# Altium project MotorDriver.PrjPcb
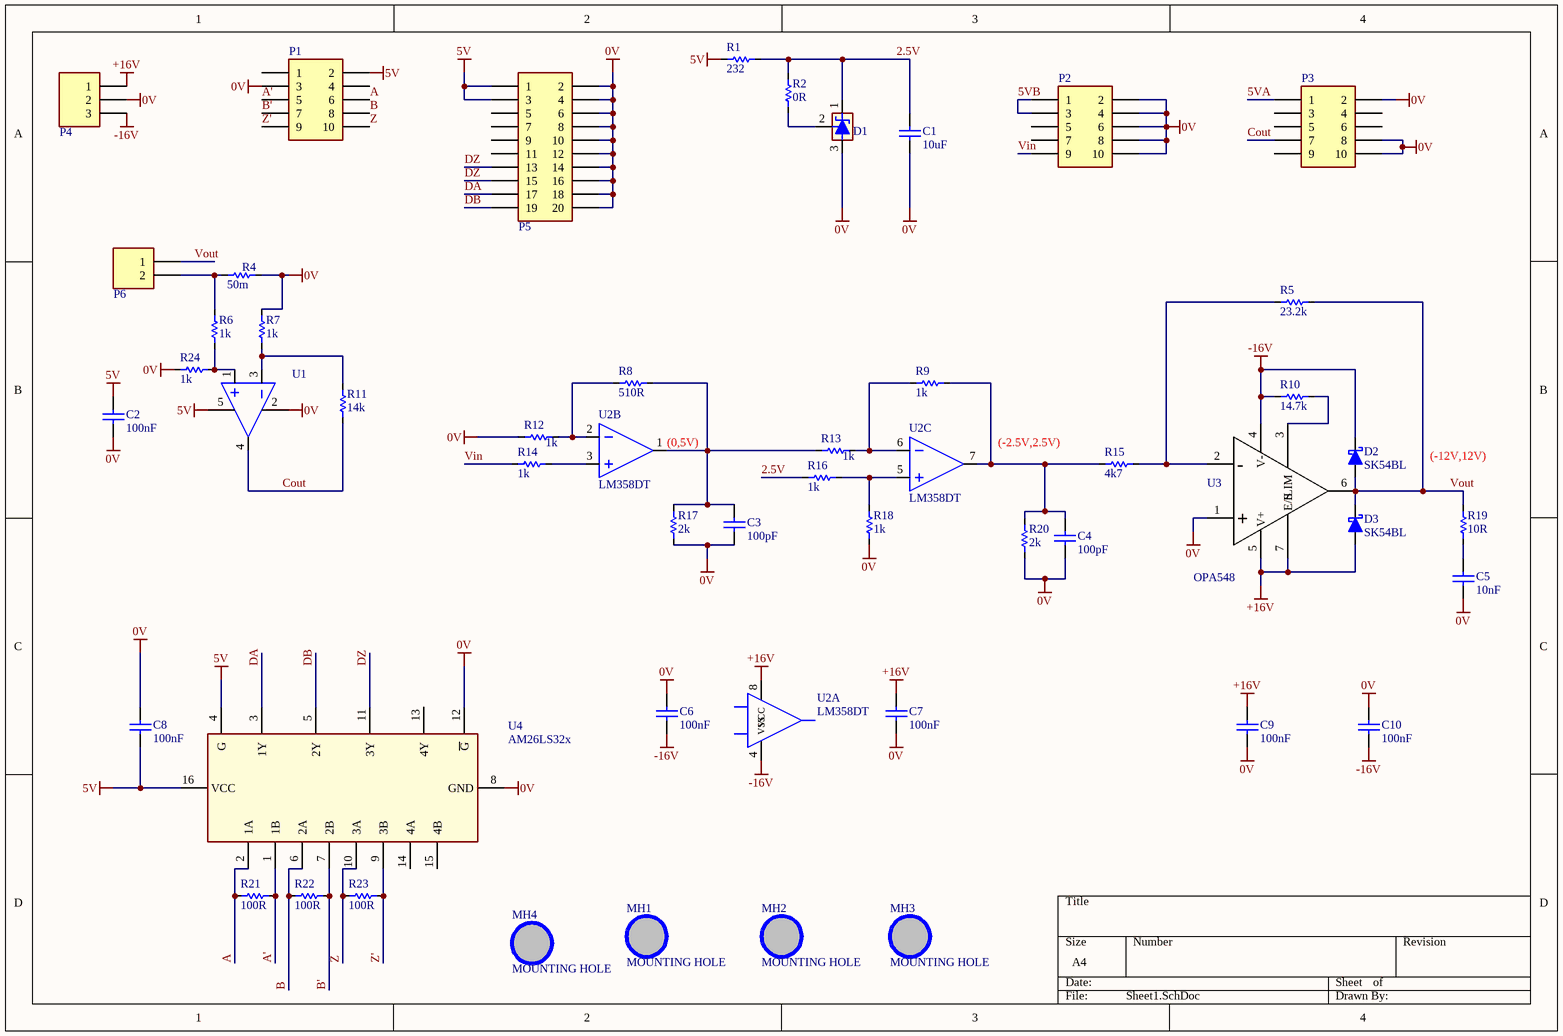
[diagram p0: Sheet1.SchDoc]
1 sheet, 50 parts. Net scope: global (net labels, ports and power ports of the same name join across sheets).
Board file: PCB.PcbDoc

## Sheet Sheet1.SchDoc
size A4; SheetNumber: 1; SheetTotal: 1

### Parts
C1  10uF  [CC3216-1206L]
C2  100nF  [CC3216-1206L]
C3  100pF  [CC3216-1206L]
C4  100pF  [CC3216-1206L]
C5  10nF  [CC3216-1206L]
C6  100nF  [CC3216-1206L]
C7  100nF  [CC3216-1206L]
C8  100nF  [CC3216-1206L]
C9  100nF  [CC3216-1206L]
C10  100nF  [CC3216-1206L]
D1  TL431  [SOT95P230X110-3N]  (value not drawn)
D2  SK54BL  [SMB]
D3  SK54BL  [SMB]
MH1  MOUNTING HOLE  [MOUNTING HOLE ROUND NONPLATED 3MM PLASTIC]  (no BOM)
MH2  MOUNTING HOLE  [MOUNTING HOLE ROUND NONPLATED 3MM PLASTIC]  (no BOM)
MH3  MOUNTING HOLE  [MOUNTING HOLE ROUND NONPLATED 3MM PLASTIC]  (no BOM)
MH4  MOUNTING HOLE  [MOUNTING HOLE ROUND NONPLATED 3MM PLASTIC]  (no BOM)
P1  CONNECTOR, 2x5, 5P  [HDR_BOX_2X5_10P_2.54MM_180]  (value not drawn)
P2  CONNECTOR, 2x5, 5P  [HDR_FEMALE_2X5_10P_2.54MM_180]  (value not drawn)
P3  CONNECTOR, 2x5, 5P  [HDR_FEMALE_2X5_10P_2.54MM_180]  (value not drawn)
P4  CONNECTOR, 1x3, 3P  [2EDGR-5.08-03P]  (value not drawn)
P5  CONNECTOR, 2x10, 20P  [HDR_MALE_2X10_20P_2.54MM_180]  (value not drawn)
P6  CONNECTOR, 1x2, 2P  [DG128-5.0-02P-14]  (value not drawn)
R1  232  [CR3216-1206l]
R2  0R  [CR3216-1206l]
R4  50m  [CR3216-1206l]
R5  23.2k  [CR3216-1206l]
R6  1k  [CR3216-1206l]
R7  1k  [CR3216-1206l]
R8  510R  [CR3216-1206l]
R9  1k  [CR3216-1206l]
R10  14.7k  [CR3216-1206l]
R11  14k  [CR3216-1206l]
R12  1k  [CR3216-1206l]
R13  1k  [CR3216-1206l]
R14  1k  [CR3216-1206l]
R15  4k7  [CR3216-1206l]
R16  1k  [CR3216-1206l]
R17  2k  [CR3216-1206l]
R18  1k  [CR3216-1206l]
R19  10R  [CR3216-1206l]
R20  2k  [CR3216-1206l]
R21  100R  [CR3216-1206l]
R22  100R  [CR3216-1206l]
R23  100R  [CR3216-1206l]
R24  1k  [CR3216-1206l]
U1  LMV321  [SOT95P280X145-5N]  (value not drawn)
U2  LM358DT  [SOIC127P600X175-8N]  (parts A,B,C of 3)
U3  OPA548  [TO127P1524X465-8N]
U4  AM26LS32x  [SOIC127P600X175-16N]

### Nets
0V: C1.2 C2.2 C3.1 C4.1 C5.1 C6.2 C7.1 C8.2 C9.1 C10.2 D1.3(A) P1.3 P2.2 P2.4 P2.6 P2.8 P2.10 P3.2 P3.8 P3.10 P4.2 P5.2 P5.4 P5.6 P5.8 P5.10 P5.12 P5.14 P5.16 P5.18 P5.20 R4.1 R7.1 R12.2 R17.2 R18.2 R20.2 R24.1 U1.2 U3.1(+) U4.8(GND) U4.12(~{G})
5V: C2.1 C8.1 P1.2 P5.1 P5.3 R1.2 U1.5(VCC) U4.4(G) U4.16(VCC)
+16V: C7.2 C9.2 D3.1 P4.1 U2.8(VCC) U3.5(V+) U3.7(E/S)
-16V: C6.1 C10.1 D2.2 P4.3 R10.2 U2.4(VSS) U3.4(V-)
2.5V: C1.1 D1.1(C) R1.1 R2.2 R16.2
5VA: P3.1
5VB: P2.1 P2.3
A: P1.6 R21.2 U4.2(1A)
A': P1.5 R21.1 U4.1(1B)
B: P1.8 R22.2 U4.6(2A)
B': P1.7 R22.1 U4.7(2B)
Cout: P3.7 R11.2 U1.4(VSS)
DA: P5.17 U4.3(1Y)
DB: P5.19 U4.5(2Y)
DZ: P5.13 P5.15 U4.11(3Y)
Vin: P2.9 R14.2
Vout: D2.1 D3.2 P6.1 R5.1 R19.2 U3.6(Vo)
Z: P1.10 R23.2 U4.10(3A)
Z': P1.9 R23.1 U4.9(3B)
NetC3_2: C3.2 R8.1 R13.2 R17.1 U2.1
NetC4_2: C4.2 R9.1 R15.2 R20.1 U2.7
NetC5_2: C5.2 R19.1
NetD1_2: D1.2(REF) R2.1
NetP6_2: P6.2 R4.2 R6.1
NetR5_2: R5.2 R15.1 U3.2(-)
NetR6_2: R6.2 R24.2 U1.1
NetR7_2: R7.2 R11.1 U1.3
NetR8_2: R8.2 R12.1 U2.2
NetR9_2: R9.2 R13.1 U2.6
NetR10_1: R10.1 U3.3(ILIM)
NetR14_1: R14.1 U2.3
NetR16_1: R16.1 R18.1 U2.5

Not connected (* = marked no-connect by the designer): P1 1 4; P2 5 7; P3 3 4 5 6 9; P5 5 7 9 11; U4 13(4Y) 14(4A) 15(4B)

### Notes on the sheet
- (near U2) (0,5V)
- (-2.5V,2.5V)
- (-12V,12V)

### Library data of the parts
C1-C10 = CAPACITOR NON-POL: Capacitor; Stock Code: *; Component Type: Capacitor
D1 = TL431: REFERENCE DIODE PIN1:C, PIN2:REF, PIN3:A; Stock Code: *; Component Type: Diode
D2 D3 = DIODE SCHOTTKY: SINGLE SCHOTTKY DIODE / Check the suitability of the case with the pin number; Stock Code: *; Component Type: Diode
P1-P3 = CONNECTOR, 2x5, 10P: Stock Code: *; Component Type: Connector
R1 R2 R4-R24 = RESISTOR: Component Type: Resistor
U1 = OPAMP1: Single Opamp / Check the suitability of the case with the pin number; Stock Code: *; Component Type: IC
U2 = OPAMP2: Dual Opamp; Stock Code: *; Component Type: IC
P4 = CONNECTOR, 1x3, 3P: Component Type: Connector
P5 = CONNECTOR, 2x10, 20P: Component Type: Connector; Stock Code: *
P6 = CONNECTOR, 1x2, 2P: Stock Code: *; Component Type: Connector